# EAGLE design pinball_ioboard (EAGLE 5.06)
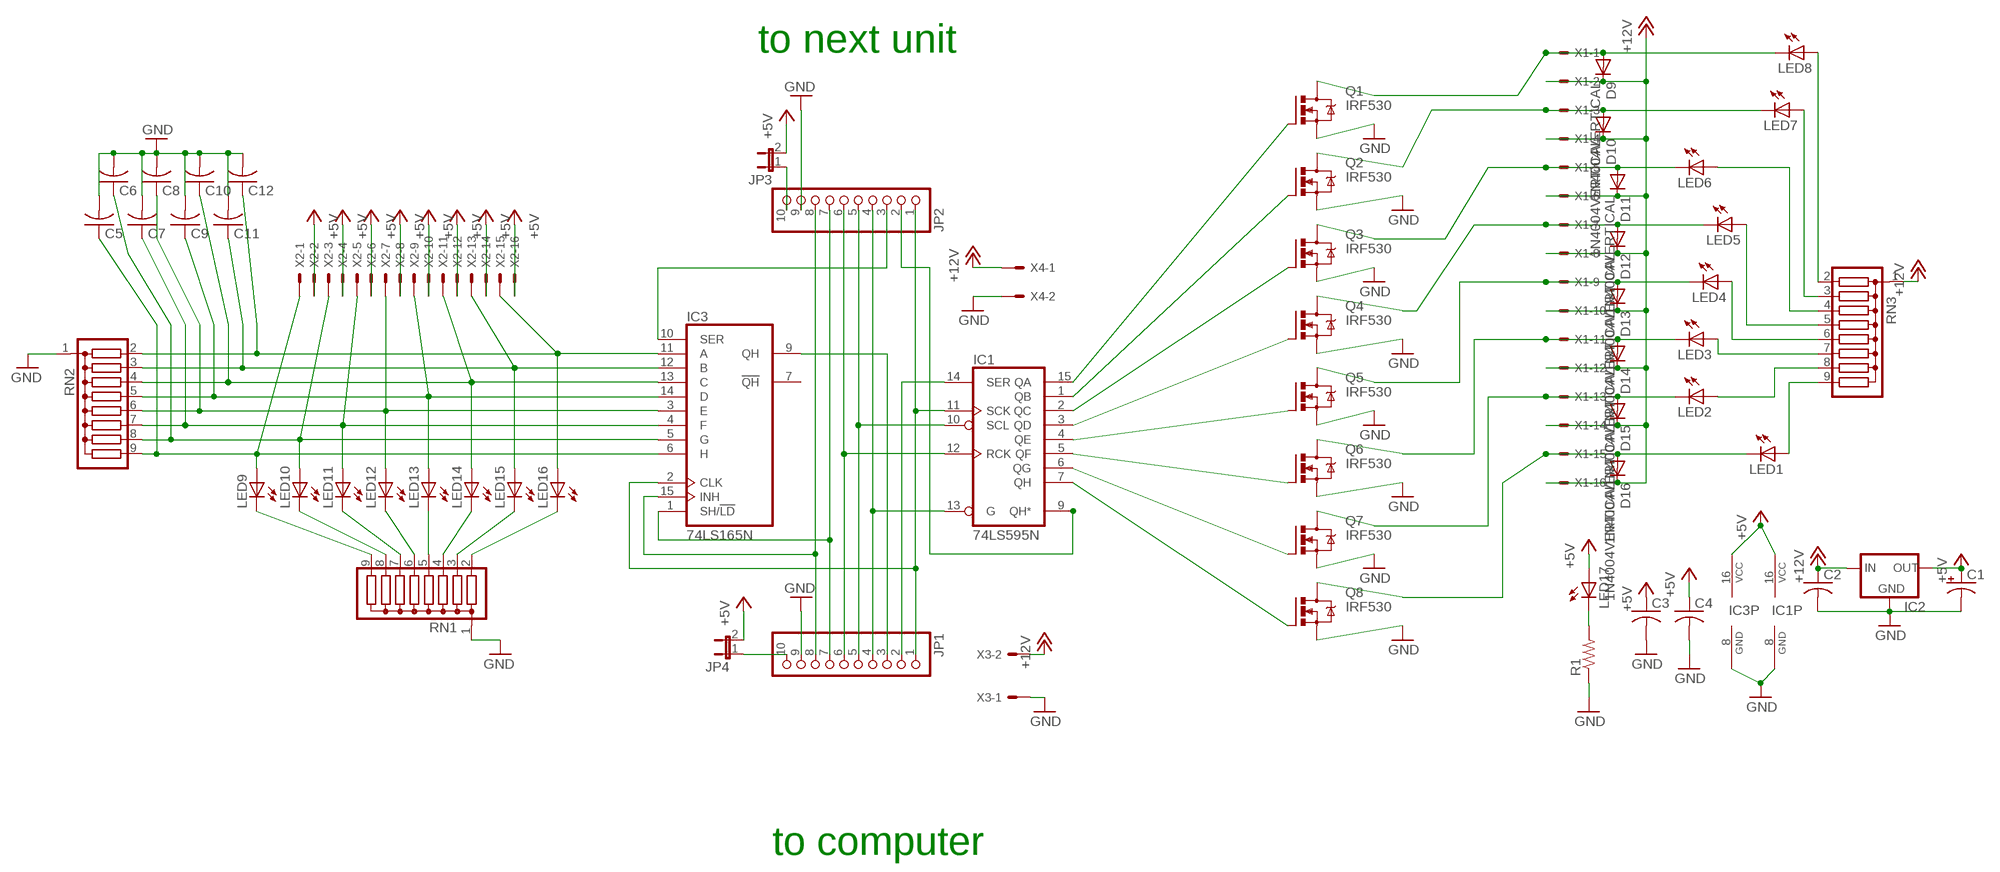
[diagram p0: schematic, sheet 1]

## Parts
C1  CPOL-USE3.5-10  [E3,5-10]
C2  C-US025-024X044  [C025-024X044]
C3  C-US025-024X044  [C025-024X044]
C4  C-US025-024X044  [C025-024X044]
C5  C-US025-024X044  [C025-024X044]
C6  C-US025-024X044  [C025-024X044]
C7  C-US025-024X044  [C025-024X044]
C8  C-US025-024X044  [C025-024X044]
C9  C-US025-024X044  [C025-024X044]
C10  C-US025-024X044  [C025-024X044]
C11  C-US025-024X044  [C025-024X044]
C12  C-US025-024X044  [C025-024X044]
D9  1N4004VERTICAL  [COMPACT_THROUGH_HOLE]
D10  1N4004VERTICAL  [COMPACT_THROUGH_HOLE]
D11  1N4004VERTICAL  [COMPACT_THROUGH_HOLE]
D12  1N4004VERTICAL  [COMPACT_THROUGH_HOLE]
D13  1N4004VERTICAL  [COMPACT_THROUGH_HOLE]
D14  1N4004VERTICAL  [COMPACT_THROUGH_HOLE]
D15  1N4004VERTICAL  [COMPACT_THROUGH_HOLE]
D16  1N4004VERTICAL  [COMPACT_THROUGH_HOLE]
IC1  74LS595N  [DIL16]
IC2  78XXS  [78XXS]
IC3  74LS165N  [DIL16]
JP1  PINHD-1X10  [1X10]
JP2  PINHD-1X10  [1X10]
JP3  JP1E  [JP1]
JP4  JP1E  [JP1]
LED1  LED5MM  [LED5MM]
LED2  LED5MM  [LED5MM]
LED3  LED5MM  [LED5MM]
LED4  LED5MM  [LED5MM]
LED5  LED5MM  [LED5MM]
LED6  LED5MM  [LED5MM]
LED7  LED5MM  [LED5MM]
LED8  LED5MM  [LED5MM]
LED9  LED5MM  [LED5MM]
LED10  LED5MM  [LED5MM]
LED11  LED5MM  [LED5MM]
LED12  LED5MM  [LED5MM]
LED13  LED5MM  [LED5MM]
LED14  LED5MM  [LED5MM]
LED15  LED5MM  [LED5MM]
LED16  LED5MM  [LED5MM]
LED17  LED5MM  [LED5MM]
Q1  IRF530  [TO220BV]
Q2  IRF530  [TO220BV]
Q3  IRF530  [TO220BV]
Q4  IRF530  [TO220BV]
Q5  IRF530  [TO220BV]
Q6  IRF530  [TO220BV]
Q7  IRF530  [TO220BV]
Q8  IRF530  [TO220BV]
R1  R-US_0309/12  [0309/12]
RN1  G08R  [SIL9]
RN2  G08R  [SIL9]
RN3  G08R  [SIL9]
X1  KK-156-16  [KK-156-16]
X2  KK-156-16  [KK-156-16]
X3  KK-156-2  [KK-156-2]
X4  KK-156-2  [KK-156-2]

## Nets
+5V: C1.+ C3.1 C4.1 IC1.16(VCC) IC2.OUT IC3.16(VCC) JP3.2 JP4.2 LED17.A X2.2 X2.4 X2.6 X2.8 X2.10 X2.12 X2.14 X2.16
+12V: C2.1 D9.P$2(C) D10.P$2(C) D11.P$2(C) D12.P$2(C) D13.P$2(C) D14.P$2(C) D15.P$2(C) D16.P$2(C) IC2.IN RN3.1 X1.2 X1.4 X1.6 X1.8 X1.10 X1.12 X1.14 X1.16 X3.2 X4.1
GND: C1.- C2.2 C3.2 C4.2 C5.2 C6.2 C7.2 C8.2 C9.2 C10.2 C11.2 C12.2 IC1.8(GND) IC2.GND IC3.8(GND) JP1.9 JP2.9 Q1.S Q2.S Q3.S Q4.S Q5.S Q6.S Q7.S Q8.S R1.1 RN1.1 RN2.1 X3.1 X4.2
N$1: C12.1 IC3.11(A) LED16.A RN2.2 X2.15
N$2: C11.1 IC3.12(B) LED15.A RN2.3 X2.13
N$3: C10.1 IC3.13(C) LED14.A RN2.4 X2.11
N$4: C9.1 IC3.14(D) LED13.A RN2.5 X2.9
N$5: C8.1 IC3.3(E) LED12.A RN2.6 X2.7
N$6: C7.1 IC3.4(F) LED11.A RN2.7 X2.5
N$7: C6.1 IC3.5(G) LED10.A RN2.8 X2.3
N$8: LED9.K(C) RN1.9
N$9: LED17.K(C) R1.2
N$10: C5.1 IC3.6(H) LED9.A RN2.9 X2.1
N$11: IC1.15(QA) Q1.G
N$12: IC1.1(QB) Q2.G
N$13: IC1.2(QC) Q3.G
N$14: IC1.3(QD) Q4.G
N$15: IC1.4(QE) Q5.G
N$16: IC1.5(QF) Q6.G
N$17: IC1.6(QG) Q7.G
N$18: JP1.10 JP4.1
N$19: LED10.K(C) RN1.8
N$20: D9.P$1(A) LED8.K(C) Q1.D X1.1
N$21: LED11.K(C) RN1.7
N$22: D10.P$1(A) LED7.K(C) Q2.D X1.3
N$23: LED12.K(C) RN1.6
N$24: D11.P$1(A) LED6.K(C) Q3.D X1.5
N$25: LED13.K(C) RN1.5
N$26: D12.P$1(A) LED5.K(C) Q4.D X1.7
N$27: LED14.K(C) RN1.4
N$28: D13.P$1(A) LED4.K(C) Q5.D X1.9
N$29: LED8.A RN3.2
N$30: D14.P$1(A) LED3.K(C) Q6.D X1.11
N$31: LED7.A RN3.3
N$32: D15.P$1(A) LED2.K(C) Q7.D X1.13
N$33: LED6.A RN3.4
N$34: D16.P$1(A) LED1.K(C) Q8.D X1.15
N$35: LED5.A RN3.5
N$36: LED4.A RN3.6
N$37: LED3.A RN3.7
N$38: LED2.A RN3.8
N$39: LED1.A RN3.9
N$40: LED15.K(C) RN1.3
N$41: LED16.K(C) RN1.2
N$42: IC3.1(SH/!LD) JP1.7 JP2.7
N$43: IC3.15(INH) JP1.8 JP2.8
N$44: IC3.9(QH) JP1.3
N$45: IC3.10(SER) JP2.3
N$46: IC1.11(SCK) IC3.2(CLK) JP1.1 JP2.1
N$47: IC1.13(G) JP1.4 JP2.4
N$48: IC1.10(SCL) JP1.5 JP2.5
N$49: IC1.12(RCK) JP1.6 JP2.6
N$50: IC1.14(SER) JP1.2
N$51: IC1.9(QH*) JP2.2
N$52: JP2.10 JP3.1
N$53: IC1.7(QH) Q8.G
Unconnected: IC3.7(!QH)

## Notes on the sheet
- to next unit
- to computer

## Library data of the parts
C1 = resistor:CPOL-US: POLARIZED CAPACITOR, American symbol
C2-C12 = rcl:C-US: CAPACITOR, American symbol
D9-D16 = diode:1N4004: DIODE general purpose rectifier, 1 A
IC1 = 74xx-us:74*595: 8-bit SHIFT REGISTER, output latch
IC2 = v-reg:78XXS: VOLTAGE REGULATOR
IC3 = 74xx-us:74*165: 8-bit parallel load SHIFT REGISTER
JP1 JP2 = pinhead:PINHD-1X10: PIN HEADER
JP3 JP4 = jumper:JP1E: JUMPER
LED1-LED17 = led:LED: LED OSRAM: - CHIPLED LG R971, LG N971, LY N971, LG Q971, LY Q971, LO R971, LY R971 LH N974, LH R974 LS Q976, LO Q976, LY Q976 LO Q996 - Hyper CHIPLED LW Q18S LB Q993, LB Q99A, LB R99A - SideLED LS A670, LO A670, LY A670, LG A670, LP A670 LB A673, LV A673, LT A673, LW A673 LH A674 LY A675 LS A676, LA A676, LO A676, LY A676, LW A676 LS A679, LY A679, LG A679 - Hyper Micro SIDELED® LS Y876, LA Y876, LO Y876, LY Y876 LT Y87S - SmartLED LW L88C, LW L88S LB L89C, LB L89S, LG L890 LS L89K, LO L89K, LY L89K LS L896, LA L896, LO L896, LY L896 - TOPLED LS T670, LO T670, LY T670, LG T670, LP T670 LSG T670, LSP T670, LSY T670, LOP T670, LYG T670 LG T671, LOG T671, LSG T671 LB T673, LV T673, LT T673, LW T673 LH T674 LS T676, LA T676, LO T676, LY T676, LB T676, LH T676, LSB T676, LW T676 LB T67C, LV T67C, LT T67C, LS T67K, LO T67K, LY T67K, LW E67C LS E67B, LA E67B, LO E67B, LY E67B, LB E67C, LV E67C, LT E67C LW T67C LS T679, LY T679, LG T679 LS T770, LO T770, LY T770, LG T770, LP T770 LB T773, LV T773, LT T773, LW T773 LH T774 LS E675, LA E675, LY E675, LS T675 LS T776, LA T776, LO T776, LY T776, LB T776 LHGB T686 LT T68C, LB T68C - Hyper Mini TOPLED® LB M676 - Mini TOPLED Santana® LG M470 LS M47K, LO M47K, LY M47K Source: http://www.osram.convergy.de LUXEON: - LUMILED® LXK2-PW12-R00, LXK2-PW12-S00, LXK2-PW14-U00, LXK2-PW14-V00 LXK2-PM12-R00, LXK2-PM12-S00, LXK2-PM14-U00 LXK2-PE12-Q00, LXK2-PE12-R00, LXK2-PE12-S00, LXK2-PE14-T00, LXK2-PE14-U00 LXK2-PB12-K00, LXK2-PB12-L00, LXK2-PB12-M00, LXK2-PB14-N00, LXK2-PB14-P00, LXK2-PB14-Q00 LXK2-PR12-L00, LXK2-PR12-M00, LXK2-PR14-Q00, LXK2-PR14-R00 LXK2-PD12-Q00, LXK2-PD12-R00, LXK2-PD12-S00 LXK2-PH12-R00, LXK2-PH12-S00 LXK2-PL12-P00, LXK2-PL12-Q00, LXK2-PL12-R00 Source: www.luxeon.com KINGBRIGHT: KA-3528ASYC Source: www.kingbright.com
Q1-Q8 = transistor-power:IRF530: HEXFET Power MOSFET
R1 = resistor:R-US_: RESISTOR, American symbol
RN1-RN3 = resistor-sil:G08R: SIL RESISTOR
X1 X2 = con-molex:KK-156-16: KK 156 HEADER Source: http://www.molex.com/pdm_docs/sd/026604100_sd.pdf
X3 X4 = con-molex:KK-156-2: KK 156 HEADER Source: http://www.molex.com/pdm_docs/sd/026604100_sd.pdf

## Board
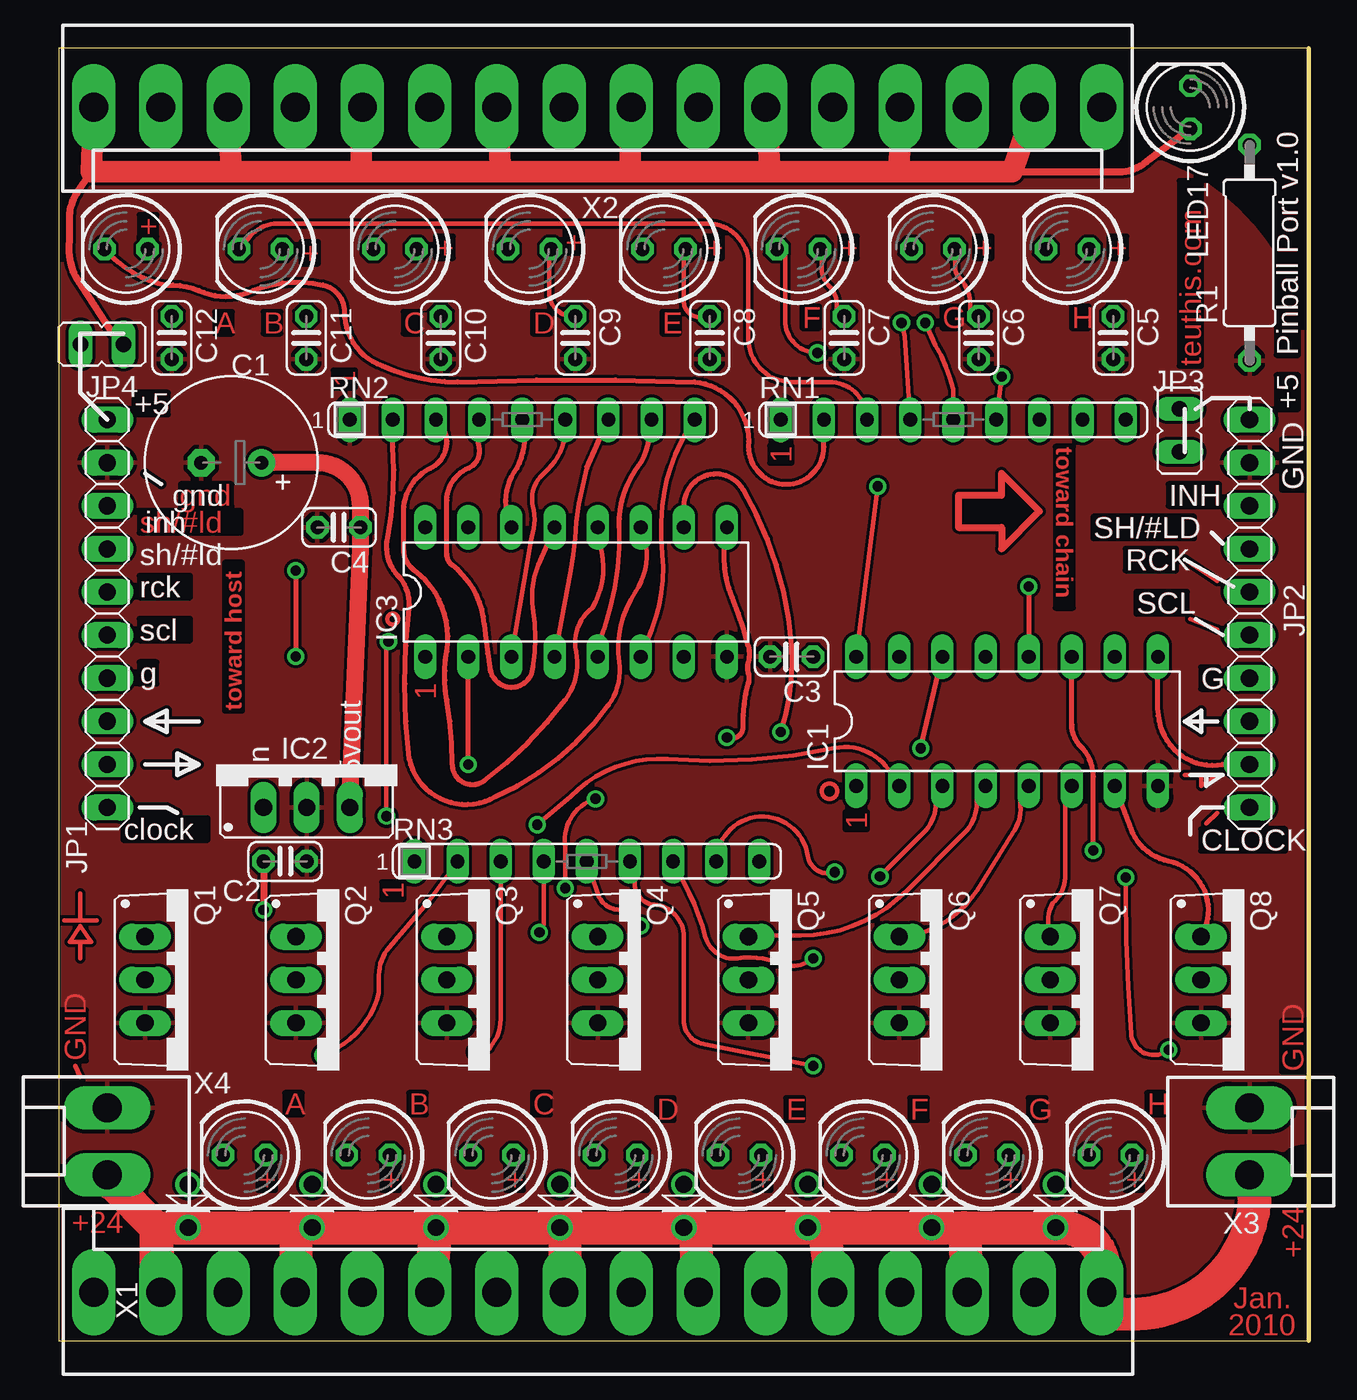
[diagram p1: board, top side]
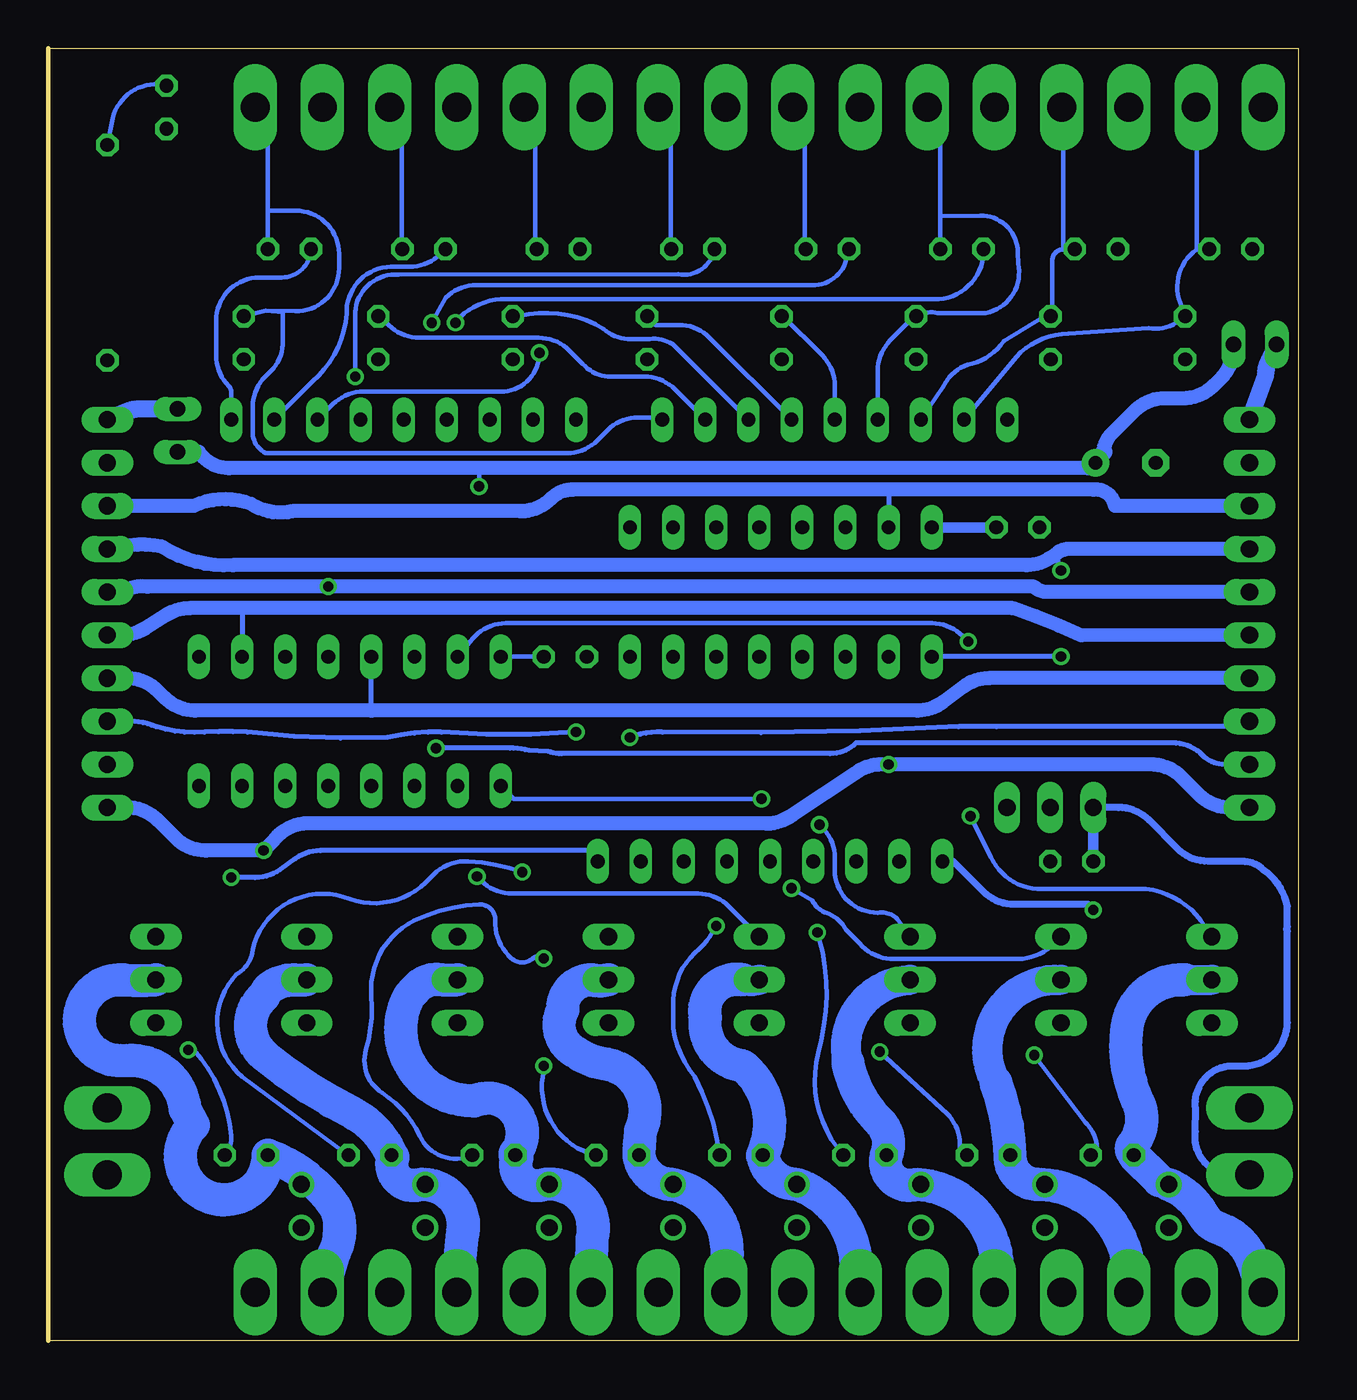
[diagram p2: board, bottom side, seen from below]

Size 73.65 x 76.19 mm. Coordinates in mm from the lower left corner, seen from the top.
Outline: 0,0 73.65,0 73.65,76.19 0,76.19 0,0
Copper layers (1*16): Top 0.035mm / dielectric 1.5mm / Bottom 0.035mm
Design rules "default *": minimum track width 10mil, minimum drill 24mil, track to track 7mil, track to pad 7mil, pad to pad 7mil, via to via 7mil, smd to smd 7mil, copper to edge 4mil, drill to drill 7mil, minimum pad ring 10mil, minimum via ring 8mil, stop-mask expansion 4mil, vias tented up to drill 0mil, thermal gap 10mil
tRestrict: area 71.8,9.8 to 74.3,11.4; area -1.3,55.6 to 84.3,78.7

### Footprints (pad centres in the part's own frame; a part is rotated, then mirrored left to right if it is on the bottom)
E3,5-10 = drill 0.813 pad 1.6 round: + -1.778,0 | drill 0.813 pad 1.6 octagon: - 1.778,0
C025-024X044 = drill 0.813 octagon: 1 -1.27,0; 2 1.27,0
COMPACT_THROUGH_HOLE = drill 1 round: P$1 -1.27,0; P$2 1.27,0
DIL16 = drill 0.813 long: 1 -8.89,-3.81; 2 -6.35,-3.81; 3 -3.81,-3.81; 4 -1.27,-3.81; 5 1.27,-3.81; 6 3.81,-3.81; 7 6.35,-3.81; 8 8.89,-3.81; 9 8.89,3.81; 10 6.35,3.81; 11 3.81,3.81; 12 1.27,3.81; 13 -1.27,3.81; 14 -3.81,3.81; 15 -6.35,3.81; 16 -8.89,3.81
78XXS = drill 1.016 long: GND 0,-2.54; IN -2.54,-2.54; OUT 2.54,-2.54
1X10 = drill 1.016 long: 1 -11.43,0; 2 -8.89,0; 3 -6.35,0; 4 -3.81,0; 5 -1.27,0; 6 1.27,0; 7 3.81,0; 8 6.35,0; 9 8.89,0; 10 11.43,0
JP1 = drill 0.914 long: 1 0,-1.27; 2 0,1.27
LED5MM = drill 0.813 octagon: A -1.27,0; K 1.27,0
TO220BV = drill 1.016 long: D 0,-2.54; G -2.54,-2.54; S 2.54,-2.54
0309/12 = drill 0.813 octagon: 1 -6.35,0; 2 6.35,0
SIL9 = drill 0.813 long: 1 -10.16,0; 2 -7.62,0; 3 -5.08,0; 4 -2.54,0; 5 0,0; 6 2.54,0; 7 5.08,0; 8 7.62,0; 9 10.16,0
KK-156-16 = drill 1.7 pad 2.184 long: 1 -29.7,0; 2 -25.74,0; 3 -21.78,0; 4 -17.82,0; 5 -13.86,0; 6 -9.9,0; 7 -5.94,0; 8 -1.98,0; 9 1.98,0; 10 5.94,0; 11 9.9,0; 12 13.86,0; 13 17.82,0; 14 21.78,0; 15 25.74,0; 16 29.7,0
KK-156-2 = drill 1.7 pad 2.184 long: 1 -1.98,0; 2 1.98,0

### Placement (x,y rotation side)
C1  10.16,51.75 180 top
C2  13.34,28.26 0 top
C3  43.18,40.32 180 top
C4  16.51,47.94 180 top
C5  62.13,59.12 270 top
C6  54.2,59.12 270 top
C7  46.28,59.12 270 top
C8  38.35,59.12 270 top
C9  30.43,59.12 270 top
C10  22.5,59.12 270 top
C11  14.58,59.12 270 top
C12  6.65,59.12 270 top
D9  7.62,7.94 270 top
D10  14.92,7.94 270 top
D11  22.23,7.94 270 top
D12  29.53,7.94 270 top
D13  36.83,7.94 270 top
D14  44.13,7.94 270 top
D15  51.44,7.94 270 top
D16  58.74,7.94 270 top
IC1  55.88,36.51 0 top
IC2  14.61,33.97 0 top
IC3  30.48,44.13 0 top
JP1  2.86,42.86 90 top
JP2  70.17,42.86 90 top
JP3  66.04,53.66 180 top
JP4  2.54,58.74 270 top
LED1  61.98,10.93 180 top
LED2  54.69,10.93 180 top
LED3  47.4,10.93 180 top
LED4  40.11,10.93 180 top
LED5  32.82,10.93 180 top
LED6  25.53,10.93 180 top
LED7  18.24,10.93 180 top
LED8  10.95,10.93 180 top
LED9  59.44,64.35 180 top
LED10  51.51,64.35 180 top
LED11  43.59,64.35 180 top
LED12  35.66,64.35 180 top
LED13  27.74,64.35 180 top
LED14  19.81,64.35 180 top
LED15  11.89,64.35 180 top
LED16  3.96,64.35 180 top
LED17  66.67,72.71 90 top
Q1  7.62,21.27 270 top
Q2  16.51,21.27 270 top
Q3  25.4,21.27 270 top
Q4  34.29,21.27 270 top
Q5  43.18,21.27 270 top
Q6  52.07,21.27 270 top
Q7  60.96,21.27 270 top
Q8  69.85,21.27 270 top
R1  70.17,64.14 90 top
RN1  52.7,54.29 0 top
RN2  27.3,54.29 0 top
RN3  31.11,28.26 0 top
X1  31.75,2.86 0 top
X2  31.75,72.71 180 top
X3  70.17,11.75 270 top
X4  2.86,11.75 90 top

### Tracks (layer width: path | path; a pad name or v marks a point on that pad's centre or on a via)
+5V  (via drill 0.61)
  Top 0.254: v48.26,50.35 IC1.16
  Top 0.406: 56.2,68.9 62.45,68.9 arc45 64.24,69.64 LED17.A | JP4.2 3.17,59.37 1.38,62.12 arc-45 0.64,64.87 0.64,66.22 arc-34 1.06,67.63 1.91,68.9
  Top 1.016: IC2.OUT 17.14,31.75 17.78,46.67 C4.1 17.78,49.21 arc90 15.24,51.75 C1.+
  Top 1.27: X2.16 1.91,68.9 10.16,68.9 | 10.16,68.9 17.78,68.9 | 17.78,68.9 26.04,68.9 | 26.04,68.9 33.66,68.9 | 33.66,68.9 41.91,68.9 | 41.91,68.9 49.53,68.9 | 49.53,68.9 56.2,68.9 X2.2 | 49.53,68.9 X2.4 | 41.91,68.9 X2.6 | 33.66,68.9 X2.8 | 26.04,68.9 X2.10 | 17.78,68.9 X2.12 | 10.16,68.9 X2.14
  Bottom 0.254: IC1.16 C3.1 | 48.26,51.44 v48.26,50.35
  Bottom 0.61: C4.1 IC3.16
  Bottom 0.813: JP4.2 3.81,58.52 arc45 4.55,56.72 4.97,56.31 arc45 6.77,55.56 7.84,55.56 arc-45 9.63,54.82 10.98,53.47 arc-45 11.43,52.39 12.38,51.44 48.26,51.44 62.99,51.44 arc56 64.77,52.39 JP3.2
  Bottom 1.016: C1.+ 11.43,52.39
+12V  (via drill 0.6)
  Top 0.406: C2.1 v12.06,25.4
  Top 1.93: 5.71,6.67 3.17,9.21 X4.1 | 5.71,6.67 5.71,4.13 | 5.71,6.67 D9.P$2 13.97,6.67 | 13.97,6.67 D10.P$2 D11.P$2 | D11.P$2 D12.P$2 29.84,6.67 | 29.84,6.67 D13.P$2 37.47,6.67 | 37.47,6.67 D14.P$2 45.09,6.67 | 45.09,6.67 D15.P$2 53.34,6.67 | 53.34,6.67 D16.P$2 59.05,6.67 arc-90 61.59,4.13 61.59,1.59 | 61.59,1.59 62.55,1.59 arc90 70.48,8.26 X3.2 | X1.2 5.71,6.67 | 13.97,6.67 X1.4 | D11.P$2 X1.6 | 29.84,6.67 X1.8 | 37.47,6.67 X1.10 | 45.09,6.67 X1.12 | 53.34,6.67 X1.14 | 61.59,1.59 X1.16
  Bottom 0.406: IC2.IN 10.58,31.43 arc45 8.78,30.69 7.09,29 arc-45 5.3,28.26 3.28,28.26 arc45 2.01,27.73 arc45 0.64,25.62 0.64,24.39 arc-45 0.64,24.13 0.64,18.73 arc89 3.18,16.19 4.13,16.2 arc-90 6.04,13.67 6.05,12.34 arc-89 4.19,9.79 X4.1 | RN3.1 20.32,28.26 18.52,26.46 arc-45 16.73,25.72 12.38,25.72 v12.06,25.4
  Bottom 0.61: IC2.IN C2.1
GND
  pour Top: -2.86,-4.13 81.92,-3.17 81.92,80.01 -2.22,80.01
N$1
  Top 0.254: 32.38,37.47 arc44 33.02,40.01 arc-42 33.97,44.13 arc58 IC3.11
  Top 0.305: 32.38,37.47 arc-30 25.72,32.07 arc-107 20.64,34.29 arc-13 20.64,43.18 arc49 20,45.09 arc-54 19.37,47.31 arc16 19.68,52.7 arc-9 RN2.2
  Bottom 0.254: 5.97,64.33 5.33,64.33 LED16.A | 5.97,64.33 arc-90 6.6,60.52 6.6,60.39 C12.1 6.73,60.39 7,60.12 arc45 8.8,59.69 13.55,59.37 arc-45 16.62,57.99 RN2.2 | 5.97,64.33 5.97,72.71 X2.15
N$2
  Top 0.254: 29.84,37.78 arc49 30.48,40.64 arc-65 31.43,43.18 arc53 31.75,47.31 arc0 IC3.12
  Top 0.305: 29.84,37.78 arc-16 25.08,33.02 arc-127 23.18,33.97 arc10 22.86,37.78 arc-19 22.86,40.64 arc63 20.95,45.4 arc-53 20.32,46.67 20.32,48.9 arc-64 21.91,51.44 arc115 RN2.3
  Bottom 0.254: 13.84,64.33 13.21,64.33 LED15.A | 13.84,64.33 arc-90 14.48,63.69 14.48,60.39 C11.1 14.92,60.39 17.35,58.91 arc45 19.47,57.53 arc-45 20.91,56.24 RN2.3 | 13.84,64.33 13.84,72.71 X2.13
N$3
  Top 0.254: IC3.13 28.26,45.72 arc32 27.94,43.18 arc-18 27.94,39.69
  Top 0.305: 27.94,39.69 arc-170 25.4,39.69 arc-5 25.08,42.23 arc48 23.18,45.72 arc-52 22.86,46.35 arc-1 22.86,49.53 arc-66 24.13,51.44 arc80 24.77,52.7 arc-27 RN2.4
  Bottom 0.254: RN2.4 24.77,57.18 arc45 24.02,58.97 22.61,60.39 C10.1 22.48,60.39 arc45 21.25,60.58 18.4,60.58 arc-91 16.5,63.49 16.51,64.14 arc-91 18.73,66.33 21.08,66.29 | 21.08,66.29 21.08,72.71 X2.11 | 21.08,66.29 LED14.A
N$4
  Top 0.254: C9.1 30.35,60.39 arc-92 28.89,61.79 28.89,63.82 28.96,64.33 LED13.A
  Top 0.305: IC3.14 arc33 26.67,48.26 arc-30 26.35,49.21 arc-40 26.99,51.44 arc46 RN2.5
  Bottom 0.254: RN2.5 27.3,56.29 arc-45 28.05,58.08 30.35,60.39 C9.1 | LED13.A 29.08,64.45 29.08,72.71 X2.9
N$5
  Top 0.254: C8.1 arc-56 37.78,60.33 arc-90 36.83,61.28 36.83,64.33 LED12.A | IC3.3 27.62,46.04 arc-4 27.94,47.62 arc26 27.94,49.21 arc-63 28.57,51.12 arc56 RN2.6
  Bottom 0.254: C8.1 37.85,59.88 36.48,59.88 arc45 34.69,59.14 RN2.6 | LED12.A 36.96,64.45 36.96,72.71 X2.7
N$6
  Top 0.254: C7.1 46.23,60.39 45.85,60.77 45.85,60.99 arc45 45.42,62.15 arc-45 44.96,63.13 44.96,64.33 LED11.A | IC3.4 30.16,45.4 arc9 30.48,48.26 arc-7 31.11,51.44
  Top 0.305: 31.11,51.44 RN2.7
  Bottom 0.254: LED11.A 44.96,64.45 44.96,72.71 X2.5 | RN2.7 36.72,58.63 arc-45 38.2,59.05 39.3,59.05 arc45 40.91,59.65 arc-45 45.88,60.39 C7.1
N$7
  Top 0.254: C6.1 54.1,60.39 53.72,60.77 53.72,60.99 arc45 52.98,62.78 arc-45 52.83,63.13 52.83,64.33 LED10.A | 33.02,47.94 arc-24 31.75,40.96 arc45 IC3.5
  Top 0.305: 33.02,47.94 arc-41 34.29,51.75 arc29 RN2.8
  Top 1.27: X2.3 53.34,71.44
  Bottom 0.254: LED10.A 52.83,64.45 52.83,72.71 X2.3 | RN2.8 36.72,56.09 arc-45 38.52,56.83 40.67,56.83 arc45 42.15,57.58 42.94,58.38 arc-45 44.74,59.12 51.78,59.12 arc45 53.58,59.86 54.1,60.39 C6.1
N$8
  Bottom 0.254: RN1.9 62.87,55.93 arc-45 63.01,56.28 arc45 63.75,58.08 63.75,60.13 arc90 61.21,62.67 59.88,62.67 arc-88 58.17,64.33 LED9.K
N$9
  Bottom 0.254: LED17.K arc-90 69.85,72.07 R1.2
N$10
  Top 0.254: IC3.6 34.92,41.91 arc27 35.56,46.35 arc-11 35.56,49.21 arc-30 RN2.9
  Bottom 0.254: 60.71,66.61 60.71,72.71 X2.1 | 60.71,66.61 LED9.A | 60.83,60.71 62.1,60.39 C5.1 | 60.83,60.71 59.09,60.68 arc-91 56.52,63.22 56.52,64.07 arc-90 59.05,66.61 60.71,66.61 | RN2.9 37.97,54.42 38.89,54.42 arc-45 40.69,53.68 41.29,53.07 arc45 43.09,52.32 60.83,52.32 arc53 61.59,53.34 61.59,55.06 arc48 60.75,56.95 60.66,57.03 arc-48 59.82,58.92 59.82,60.64 60.83,60.71
N$11  (via drill 0.61)
  Top 0.254: v19.43,41.21 19.3,41.08 v19.3,30.92
  Bottom 0.254: IC1.15 48.64,41.38 arc50 46.69,42.29 21.56,42.29 arc45 19.77,41.55 v19.43,41.21 | v19.3,30.92 18.1,28.52 arc-63 15.36,26.64 8.96,26.64 arc45 5.73,24.78 Q1.G
N$12  (via drill 0.61)
  Top 0.254: v29.84,26.67 29.84,29.21 arc-82 31.61,31.92 v31.62,31.94
  Bottom 0.254: IC1.1 46.23,31.94 v31.62,31.94 | v29.84,26.67 28.62,25.95 arc-45 27.78,25.21 arc45 26.65,24.24 25.83,23.41 arc-45 24.03,22.5 16.5,22.5 arc-45 14.37,23.41 Q2.G
N$13  (via drill 0.61)
  Top 0.254: v28.19,30.42 30.16,32.07 arc-50 35.88,34.29 arc16 45.72,34.92 arc-67 48.9,33.66 arc-2 IC1.2
  Bottom 0.254: v28.19,30.42 28.05,30.27 arc45 27.3,28.48 27.3,27.76 arc-90 24.77,25.22 arc56 23.61,24.86 Q3.G
N$14  (via drill 0.61)
  Top 0.254: IC1.3 51.69,32.32 51.69,31.72 arc-45 50.95,29.93 v48.39,27.37
  Bottom 0.254: Q4.G 33.55,25.61 arc-45 35.34,26.35 46.32,26.35 arc45 48.12,27.1 v48.39,27.37
N$15
  Top 0.254: IC1.4 54.1,32.19 54.1,31.72 arc-45 53.36,29.93 49.96,26.52 arc-45 43.72,23.88 40.64,23.88 | 40.64,23.88 arc90 40.58,23.81 40.64,23.88 | 40.64,23.88 arc-90 40.39,23.94 40.45,23.94 arc90 Q5.G
N$16
  Top 0.254: IC1.5 56.64,32.19 56.64,31.72 arc-45 56.22,29.93 54.16,26.6 arc-45 50.23,23.88 arc90 49.47,23.43 Q6.G
N$17
  Top 0.254: IC1.6 59.31,32.32 59.31,27.28 arc-45 58.56,25.8 arc45 58.42,23.86 Q7.G
N$18
  Bottom 1.016: JP1.10 1.91,56.89 arc45 1.27,58.42 JP4.1
N$19
  Bottom 0.254: RN1.8 58.08,56.53 arc-45 56.07,60.55 56.07,60.77 arc90 53.21,63.31 52.36,63.31 arc-45 50.56,64.05 50.29,64.33 LED10.K
N$20
  Bottom 0.406: D9.P$1 arc45 8.18,9.44
  Bottom 1.778: 6.67,21.27 Q1.D
  Bottom 1.93: X1.1 2.64,4.62 arc-53 4.62,6.6 arc43 5.61,7.43 arc-39 D9.P$1 | 8.18,9.44 LED8.K arc-90 9.69,11.05 arc91 9.74,11.56 arc-65 9.41,14.03 arc33 10.07,18.49 arc86 6.67,21.27
N$21  (via drill 0.61)
  Top 0.254: v44.7,58.23 arc-90 42.8,60.13 42.8,64.33 42.42,64.33 LED11.K
  Bottom 0.254: v44.7,58.23 arc90 46.99,55.94 55.08,55.94 arc-45 56.88,55.2 RN1.7
N$22
  Bottom 0.406: 15.24,9.21 D10.P$1
  Bottom 1.778: 17.8,15.23 arc122 Q2.D
  Bottom 1.93: X1.3 9.97,3.62 arc-90 15.24,9.21 arc95 LED7.K arc-18 17.8,15.23
N$23  (via drill 0.61)
  Top 0.254: v55.56,56.83 RN1.6
  Bottom 0.254: v55.56,56.83 55.56,60.63 arc90 53.01,62.85 36.51,62.87 arc-90 LED12.K
N$24
  Bottom 0.406: 22.54,9.21 D11.P$1
  Bottom 1.778: 26.53,16.4 arc100 Q3.D
  Bottom 1.93: 26.53,16.4 arc-32 24.77,13.02 arc71 LED6.K arc-122 22.54,9.21 arc104 X1.5
N$25  (via drill 0.61)
  Top 0.254: v51.05,60.01 51.66,58.7 arc-16 52.7,56.1 RN1.5
  Bottom 0.254: v51.05,60.01 50.21,61.49 arc45 48.41,62.23 28.45,62.23 arc-87 26.54,64.32 26.54,64.33 LED13.K
N$26
  Bottom 1.778: 32.7,21.27 arc-33 Q4.D
  Bottom 1.93: X1.7 26.04,4.45 arc-69 D12.P$1 arc80 LED5.K arc-75 32.7,16.19 arc91 34.92,19.05 arc113 32.7,21.27
N$27  (via drill 0.61)
  Top 0.254: v49.66,60.01 49.85,59.18 RN1.4
  Bottom 0.254: v49.66,60.01 49.66,60.07 49.38,60.34 arc45 46.64,61.4 21.73,61.4 arc-89 18.55,63.89 18.54,64.33 LED14.K
N$28
  Bottom 1.93: X1.9 33.66,4.76 arc-84 D13.P$1 arc83 LED4.K arc3 38.73,12.38 arc-108 40.92,16.33 arc28 42.53,16.98 arc92 43.32,19.52 arc95 41.59,21.27 arc-28 Q5.D
N$29  (via drill 0.6)
  Top 0.254: v15.55,16.83 arc55 18.86,20.5 18.86,21.54 arc-41 19.47,23.19 21.84,25.97 RN3.2
  Bottom 0.254: v15.55,16.83 12.55,12.88 arc55 11.87,10.99 LED8.A
N$30
  Bottom 0.406: 44.45,9.21 D14.P$1
  Bottom 1.93: X1.11 41.59,6.03 arc-111 44.45,9.21 arc130 46.04,10.79 arc-49 LED3.K arc112 46.04,11.11 arc-146 48.55,14.13 arc119 52.38,20.33 arc-1 52.07,20.64 arc66 50.48,21.27 arc-4 Q6.D
N$31  (via drill 0.6)
  Top 0.254: v24.66,17.04 arc45 25.4,17.25 25.83,17.94 arc23 26.04,19.25 RN3.3
  Bottom 0.254: v24.66,17.04 20.68,13.38 arc45 19.94,11.58 19.94,11.37 LED7.A
N$32
  Bottom 0.406: 51.75,9.21 D15.P$1
  Bottom 1.93: X1.13 49.21,6.35 arc-104 51.75,9.21 arc126 53.34,10.79 arc-41 LED2.K arc-37 55.56,13.34 arc13 60.95,16.83 arc96 60.95,20.32 60.69,20.77 arc37 59.16,21.27 Q7.D
N$33  (via drill 0.6)
  Top 0.254: v28.32,24.07 arc45 28.57,24.68 RN3.4
  Bottom 0.254: LED6.A arc56 28.27,16.97 28.11,17.71 arc-25 28.02,22.88 v28.32,24.07
N$34
  Bottom 0.406: D16.P$1 57.06,7.53 arc-45 56.68,7.8
  Bottom 1.93: X1.15 56.83,5.08 arc-48 56.68,7.8 arc-36 LED1.K arc227 65.09,12.71 65.58,13.65 arc-88 68.9,16.51 arc5 69.53,16.51 arc182 69.22,21.27 arc-10 Q8.D
N$35  (via drill 0.6)
  Top 0.254: RN3.5 31.75,26.35 arc69 33.02,25.4 arc-69 v34.29,24.45
  Bottom 0.254: v34.29,24.45 arc27 35.56,22.86 arc-48 36.83,19.68 arc4 36.83,18.41 arc-30 35.56,15.56 arc21 LED5.A
N$36  (via drill 0.6)
  Top 0.254: RN3.6 33.97,27.3 arc90 34.92,25.72 arc-90 36.83,23.81 36.83,19.05 arc90 38.1,17.46 v44.45,16.19
  Bottom 0.254: v44.45,16.19 44.45,15.91 arc-90 LED4.A
N$37  (via drill 0.6)
  Top 0.254: RN3.7 37.15,26.35 arc-12 38.1,23.81 arc84 40.01,22.54 arc-30 42.55,22.23 arc64 v44.45,22.54
  Bottom 0.254: v44.45,22.54 arc-82 45.09,22.54 arc82 46.35,22.54 arc51 47.31,24.77 arc-95 48.26,25.72 arc-23 52.07,24.77 arc-69 54.61,20.32 arc21 54.93,17.14 arc-74 53.98,14.61 arc32 51.75,12.06 arc-90 LED3.A
N$38  (via drill 0.6)
  Top 0.254: v45.72,27.62 arc-102 44.13,28.57 arc170 RN3.8
  Bottom 0.254: LED2.A 62.23,15.56 arc93 62.56,21.59 arc-54 61.61,23.02 arc100 55.88,26.04 arc-69 51.12,27.3 arc52 48.9,28.26 arc17 v45.72,27.62
N$39  (via drill 0.6)
  Top 0.254: v62.87,27.3 62.87,26.35 arc4 63.18,18.1 arc125 v65.41,17.14
  Bottom 0.254: v65.41,17.14 arc95 65.09,17.14 arc37 62.87,12.06 arc47 LED1.A
  Bottom 0.305: RN3.9 41.01,28.26 arc45 41.27,28.89 57.61,28.89 arc-36 59.08,28.42 59.98,27.78 arc36 61.46,27.3 v62.87,27.3
N$40
  Top 0.254: RN1.3 arc90 45.4,56.52 43.18,56.52 arc-90 40.64,59.05 40.64,63.5 arc90 38.23,65.85 13.08,65.85 arc90 10.73,63.82 10.67,64.45 LED15.K
N$41
  Top 0.305: RN1.2 45.09,52.7 arc-180 40.64,52.7 arc90 37.47,56.52 arc4 23.5,56.52 arc-24 19.05,57.47 arc-71 16.83,60.64 arc78 15.56,62.23 arc33 11.43,61.91 arc-51 8.26,61.91 arc23 6.35,62.23 arc-38 LED16.K
N$42  (via drill 0.6)
  Top 0.305: v13.97,45.4 v13.97,40.32
  Bottom 0.305: v13.97,40.32 IC3.1 | 14.29,46.35 v13.97,45.4
  Bottom 0.813: JP1.7 13.52,46.67 arc-45 14.29,46.35 14.6,46.15 arc34 16.01,45.72 62.76,45.72 arc37 66.95,46.8 arc-37 70.7,46.35 JP2.7
N$43
  Bottom 0.305: 24.13,50.16 IC3.15
  Bottom 0.813: JP1.8 10.79,49.21 arc-90 12.06,50.16 24.13,50.16 42.75,50.16 arc-45 44.02,49.64 arc45 45.82,48.9 59.27,48.9 arc45 61.7,49.32 arc-45 65.06,49.21 69.27,49.21 arc-45 69.85,49.21 JP2.8
N$44  (via drill 0.6)
  Top 0.305: v39.37,35.56 arc115 40.32,36.2 arc-16 40.64,38.73 arc31 40.64,39.37 arc-31 40.64,40.01 arc31 40.64,40.96 arc6 39.69,43.81 arc-34 IC3.9
  Bottom 0.305: JP1.3 arc45 3.62,36.2 17.78,36.2 arc-3 20,36.2 arc4 37.47,35.88 arc-25 v39.37,35.56
N$45  (via drill 0.6)
  Top 0.305: 42.23,35.88 arc-5 v42.55,35.88 arc22 43.18,40.96 arc27 40.32,50.16 arc149 36.83,49.21 IC3.10
  Bottom 0.305: JP2.3 68.58,36.51 arc19 67.31,36.2 arc-22 64.45,35.88 arc5 61.91,35.88 arc-9 53.66,35.56 arc14 50.48,35.88 arc-9 v42.55,35.88
N$46  (via drill 0.6)
  Top 0.305: v24.13,33.97 IC3.2 | v60.96,28.89 60.96,33.24 arc45 60.22,35.03 arc-45 59.69,36.3 IC1.11
  Bottom 0.813: JP1.1 4.03,31.43 arc45 5.82,32.18 6.88,33.23 arc-45 8.67,33.97 v24.13,33.97 24.55,33.97 arc-37 26.08,33.47 29.8,30.99 arc37 31.33,30.48 58.64,30.48 arc-45 60.43,29.42 v60.96,28.89 64.35,28.89 arc45 66.15,29.64 67.2,30.69 arc-45 69,31.43 JP2.1
N$47
  Bottom 0.305: 54.61,37.15 IC1.13
  Bottom 0.813: JP2.4 69,39.05 arc45 67.2,38.31 66.78,37.89 arc-45 64.99,37.15 54.61,37.15 22.44,37.15 arc-37 20.91,37.66 19.73,38.54 arc37 18.2,39.05 JP1.4
N$48
  Bottom 0.305: 62.23,43.18 IC1.10
  Bottom 0.813: JP2.5 69.31,41.59 arc-32 67.96,41.98 66.66,42.79 arc32 65.31,43.18 62.23,43.18 16.83,43.18 arc6 12.77,41.58 JP1.5
N$49  (via drill 0.6)
  Top 0.305: v57.15,44.45 IC1.12
  Bottom 0.813: JP1.6 14.79,44.13 arc45 15.56,44.45 v57.15,44.45 67.81,44.45 arc-45 69.22,44.13 JP2.6
N$50  (via drill 0.6)
  Top 0.305: v50.8,34.92 IC1.14
  Bottom 0.305: JP1.2 4.34,33.97 arc45 5.61,34.5 arc-45 7.4,35.24 26.04,35.24 arc45 27.57,34.61 43.4,34.61 arc18 44.21,34.74 45.33,34.8 arc-18 46.45,34.92 v50.8,34.92
N$51
  Top 0.305: IC1.9 64.77,37.15 arc100 68.58,33.97 arc-21 JP2.2
N$52
  Bottom 1.016: JP3.1 68.17,54.93 arc-18 68.97,54.8 JP2.10
N$53
  Top 0.305: IC1.7 63.18,30.16 arc58 65.41,28.26 arc-110 Q8.G
N$54
  Top 0.254: 6.03,50.48 5.08,51.12
N$55
  Top 0.406: 53.02,49.85 55.56,49.85 55.56,51.12 57.78,48.9 55.56,46.67 55.56,47.94 53.02,47.94 53.02,49.85
N$56
  Top 0.254: 1.27,15.56 0.95,16.19
N$58
  Top 0.254: 68.26,44.77 66.36,46.04
N$59
  Top 0.254: 66.67,42.55 68.26,41.91
N$60
  Top 0.254: 5.08,36.51 8.26,36.51 | 5.08,36.51 6.35,37.15 6.35,35.88 5.08,36.51
N$61
  Top 0.254: 66.36,36.51 68.26,36.51 | 66.36,36.51 67.31,37.15 67.31,35.88 66.36,36.51
N$62
  Top 0.254: 8.26,33.97 5.08,33.97 | 8.26,33.97 6.99,34.61 6.99,33.34 8.26,33.97
N$63
  Top 0.254: 67.31,33.34 66.36,33.34 | 67.31,33.34 68.26,33.34 67.31,32.7 67.31,33.34
N$64
  Top 0.254: 6.99,31.11 6.35,31.43 4.76,31.43
N$65
  Top 0.254: 68.26,31.11 67.63,30.48
N$66
  Top 0.254: 1.27,22.54 1.27,23.5 | 1.27,23.5 0.64,23.5 1.27,24.45 1.91,23.5 1.27,23.5
N$67
  Top 0.254: 1.27,24.77 0.32,24.77 | 1.27,24.77 2.22,24.77 | 1.27,24.77 1.27,26.35
(copper drawn outside any net)
  shapes: Top circle x2

### Text on the board
Top: + | + | + | + | + | + | + | + | F | G | H | A | B | C | D | E | Pinball Port v1.0 | teuthis.com | 1 | +5 | +5 | toward chain | 1 | gnd | GND | INH | sh/#ld | inh | SH/#LD | RCK | rck | SCL | scl | g | 1 | G | toward host | clock | 1 | CLOCK | 1 | GND | GND | A | B | C | D | E | F | G | H | + | + | + | + | + | + | + | + | +24 | +24 | Jan. | 2010
tNames: Pinball Port v1.0 | +5 | +5 | GND | gnd | INH | inh | SH/#LD | sh/#ld | RCK | rck | SCL | scl | g | G | in | 5vout | clock | CLOCK